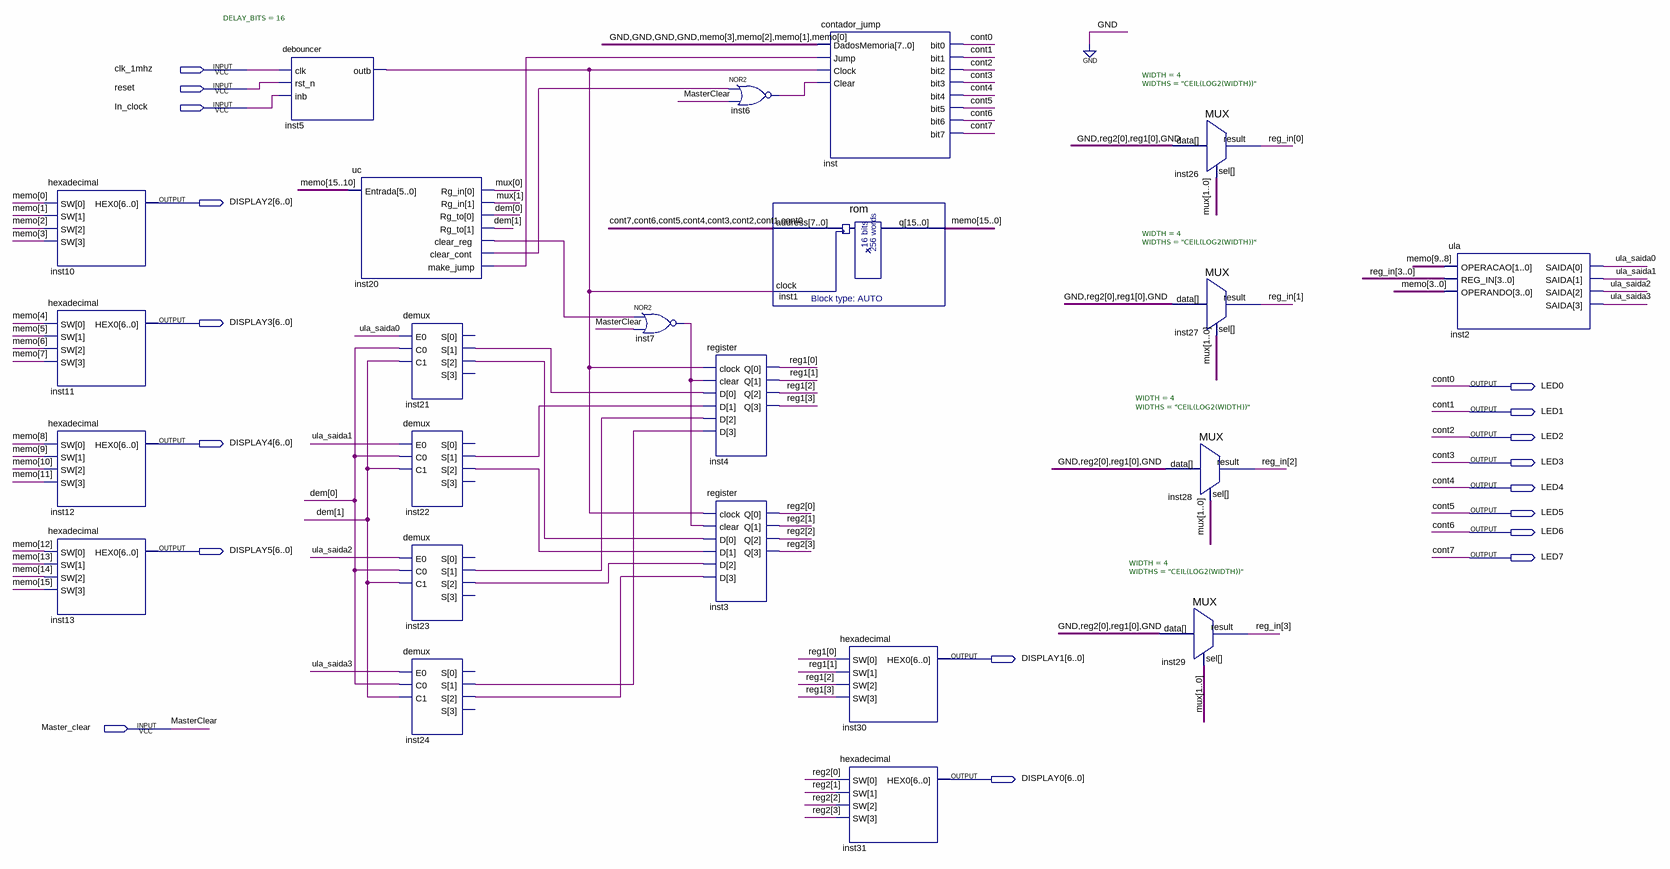
[diagram p0: schematic sheet]
// Quartus schematic copia.bdf as structural Verilog: 23 symbols, 18 pins
module copia (
  input  clk_1mhz,
  input  reset,
  input  In_clock,
  input  Master_clear,
  output [6:0] DISPLAY2,
  output [6:0] DISPLAY3,
  output LED0,
  output LED1,
  output LED2,
  output [6:0] DISPLAY4,
  output LED3,
  output LED4,
  output LED5,
  output LED6,
  output [6:0] DISPLAY5,
  output LED7,
  output [6:0] DISPLAY1,
  output [6:0] DISPLAY0
);

  wire inst5_outb, inst6_out, inst7_out, inst20_clear_cont, inst20_clear_reg, inst20_make_jump, inst21_s,
       inst21_s_2, inst22_s, inst22_s_2, inst23_s, inst23_s_2, inst24_s, inst24_s_2, ula_saida0, ula_saida1,
       ula_saida2, ula_saida3;
  wire [1:0] dem, mux;
  wire [3:0] reg1, reg2, reg_in;
  wire [15:0] memo;
  wire [3:0] inst24_s_open;  // unused outputs
  wire [3:0] inst23_s_open;  // unused outputs
  wire [3:0] inst22_s_open;  // unused outputs
  wire [3:0] inst21_s_open;  // unused outputs

  hexadecimal inst10 (.SW(memo[3:0]), .HEX0(DISPLAY2));
  hexadecimal inst11 (.SW(memo[7:4]), .HEX0(DISPLAY3));
  hexadecimal inst12 (.SW(memo[11:8]), .HEX0(DISPLAY4));
  hexadecimal inst13 (.SW(memo[15:12]), .HEX0(DISPLAY5));
  debouncer #(.DELAY_BITS(16)) inst5 (.clk(clk_1mhz), .rst_n(reset), .inb(In_clock), .outb(inst5_outb));
  uc inst20 (
    .Entrada(memo[15:10]), .Rg_in(mux), .Rg_to(dem), .clear_reg(inst20_clear_reg),
    .clear_cont(inst20_clear_cont), .make_jump(inst20_make_jump));
  demux inst21 (
    .E0(ula_saida0), .C0(dem[0]), .C1(dem[1]), .S({inst21_s_open[3], inst21_s_2, inst21_s, inst21_s_open[0]}));
  demux inst22 (
    .E0(ula_saida1), .C0(dem[0]), .C1(dem[1]), .S({inst22_s_open[3], inst22_s_2, inst22_s, inst22_s_open[0]}));
  demux inst23 (
    .E0(ula_saida2), .C0(dem[0]), .C1(dem[1]), .S({inst23_s_open[3], inst23_s, inst23_s_2, inst23_s_open[0]}));
  demux inst24 (
    .E0(ula_saida3), .C0(dem[0]), .C1(dem[1]), .S({inst24_s_open[3], inst24_s_2, inst24_s, inst24_s_open[0]}));
  nor inst7 (inst7_out, inst20_clear_reg, Master_clear);
  nor inst6 (inst6_out, inst20_clear_cont, Master_clear);
  register inst4 (.clock(inst5_outb), .clear(inst7_out), .D({inst24_s, inst23_s_2, inst22_s, inst21_s}), .Q(reg1));
  register inst3 (.clock(inst5_outb), .clear(inst7_out), .D({inst24_s_2, inst23_s, inst22_s_2, inst21_s_2}), .Q(reg2));
  rom inst1 (.address({LED7, LED6, LED5, LED4, LED3, LED2, LED1, LED0}), .clock(inst5_outb), .q(memo));
  contador_jump inst (
    .DadosMemoria({4'b0000, memo[3:0]}), .Jump(inst20_make_jump), .Clock(inst5_outb), .Clear(inst6_out),
    .bit0(LED0), .bit1(LED1), .bit2(LED2), .bit3(LED3), .bit4(LED4), .bit5(LED5), .bit6(LED6), .bit7(LED7));
  hexadecimal inst30 (.SW(reg1), .HEX0(DISPLAY1));
  hexadecimal inst31 (.SW(reg2), .HEX0(DISPLAY0));
  MUX #(.WIDTH(4), .WIDTHS("CEIL(LOG2(WIDTH))")) inst26 (
    .data({1'b0, reg2[0], reg1[0], 1'b0}), .sel(mux), .result(reg_in[0]));
  MUX #(.WIDTH(4), .WIDTHS("CEIL(LOG2(WIDTH))")) inst27 (
    .data({1'b0, reg2[0], reg1[0], 1'b0}), .sel(mux), .result(reg_in[1]));
  MUX #(.WIDTH(4), .WIDTHS("CEIL(LOG2(WIDTH))")) inst28 (
    .data({1'b0, reg2[0], reg1[0], 1'b0}), .sel(mux), .result(reg_in[2]));
  MUX #(.WIDTH(4), .WIDTHS("CEIL(LOG2(WIDTH))")) inst29 (
    .data({1'b0, reg2[0], reg1[0], 1'b0}), .sel(mux), .result(reg_in[3]));
  ula inst2 (
    .OPERACAO(memo[9:8]), .REG_IN(reg_in), .OPERANDO(memo[3:0]),
    .SAIDA({ula_saida3, ula_saida2, ula_saida1, ula_saida0}));

  // Other names for the same wires on the sheet: cont0 = LED0; cont1 = LED1; cont2 = LED2; cont3 = LED3; cont4 = LED4;
  //   cont5 = LED5; cont6 = LED6; cont7 = LED7; MasterClear = Master_clear
endmodule
